# EAGLE design connector_v3 (EAGLE 7.3.0)
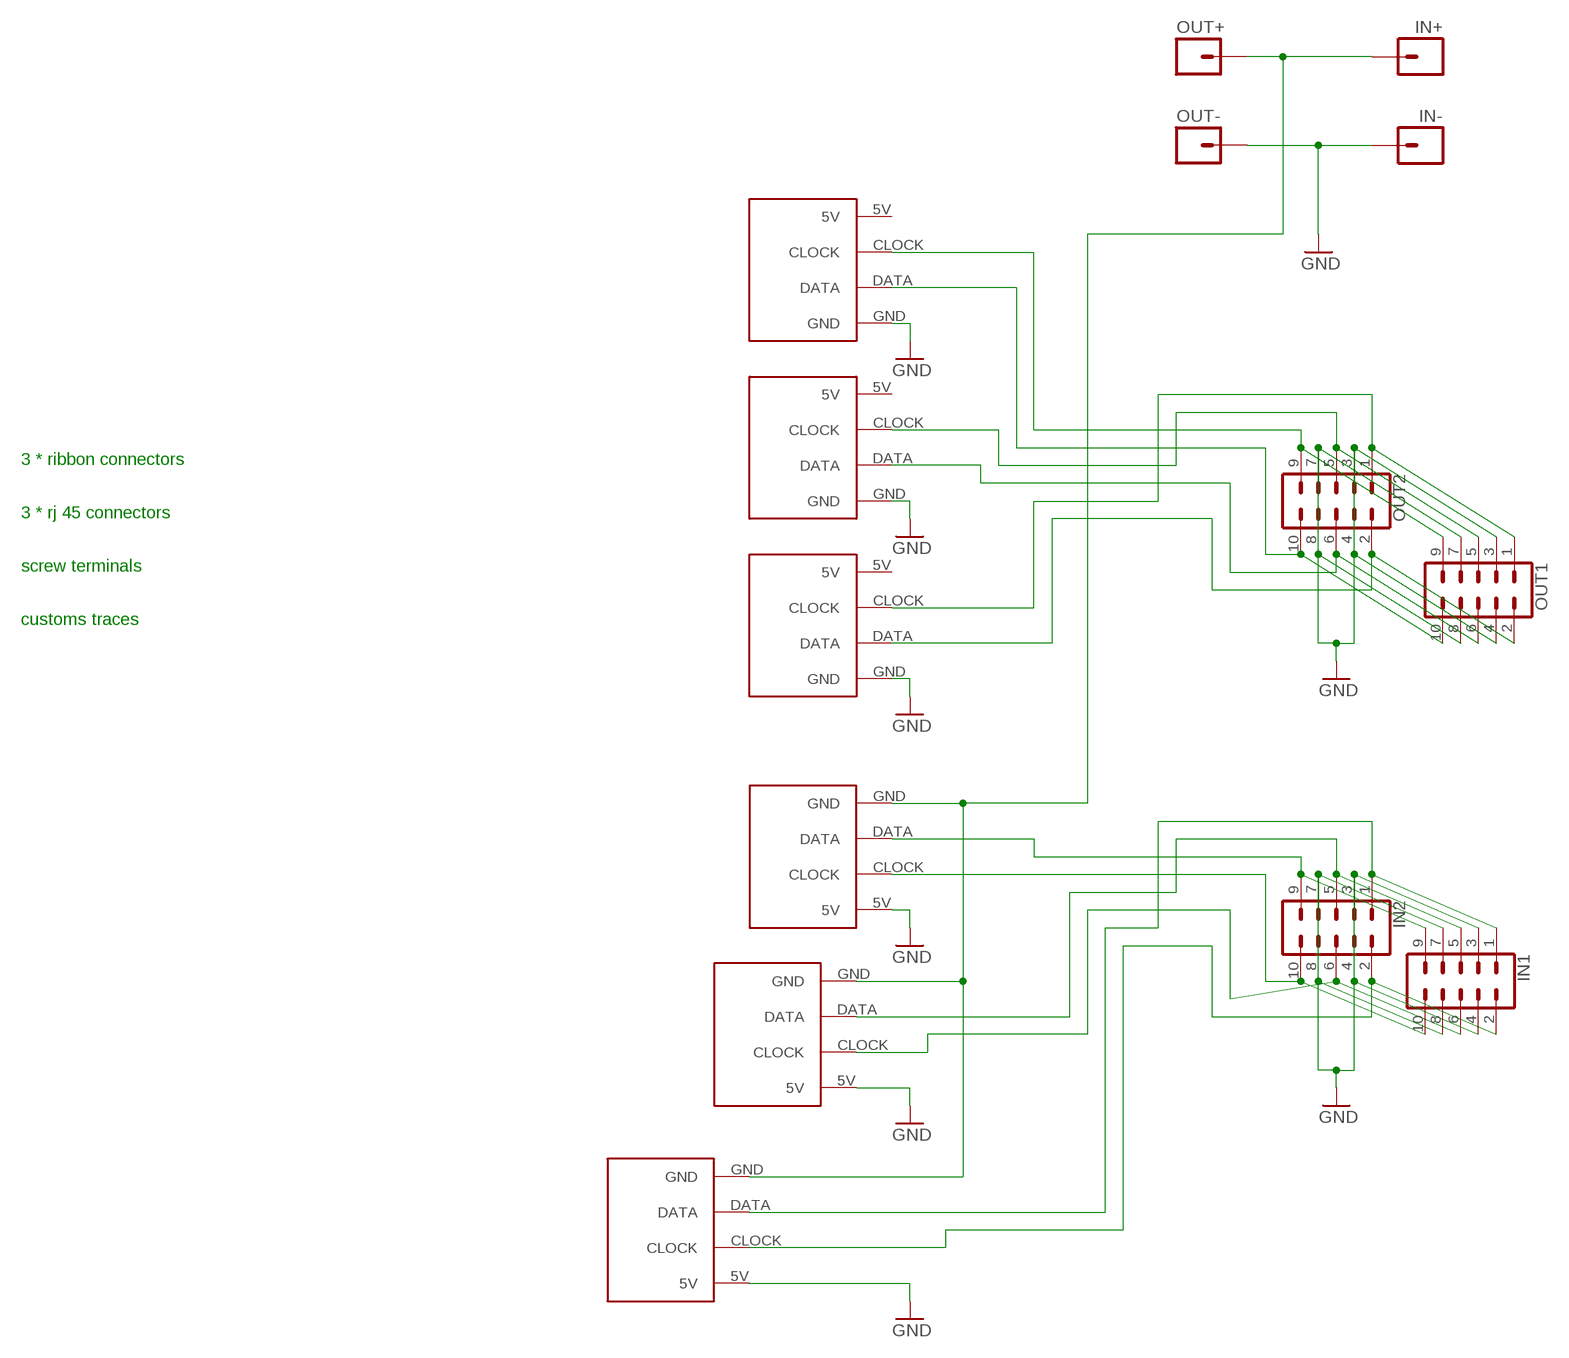
[diagram p0: schematic, sheet 1]

## Parts
IN1  CONN_05X2SHD_LOCK  [2X5-SHROUDED_LOCK]
IN2  CONN_05X2SHD_LOCK  [2X5-SHROUDED_LOCK]
IN+  M01PTH_2MM  [1X01_2MM]
IN-  M01PTH_2MM  [1X01_2MM]
INSTRIP1  APA102STRIP  [APA102STRIP]
INSTRIP2  APA102STRIP  [APA102STRIP]
INSTRIP3  APA102STRIP  [APA102STRIP]
OUT1  CONN_05X2SHD_LOCK  [2X5-SHROUDED_LOCK]
OUT2  CONN_05X2SHD_LOCK  [2X5-SHROUDED_LOCK]
OUT+  M01PTH_2MM  [1X01_2MM]
OUT-  M01PTH_2MM  [1X01_2MM]
OUTSTRIP1  APA102STRIP  [APA102STRIP]
OUTSTRIP2  APA102STRIP  [APA102STRIP]
OUTSTRIP3  APA102STRIP  [APA102STRIP]

## Nets
GND: IN1.3 IN1.4 IN1.7 IN1.8 IN2.3 IN2.4 IN2.7 IN2.8 IN-.1 INSTRIP1.5V INSTRIP2.5V INSTRIP3.5V OUT1.3 OUT1.4 OUT1.7 OUT1.8 OUT2.3 OUT2.4 OUT2.7 OUT2.8 OUT-.1 OUTSTRIP1.GND OUTSTRIP2.GND OUTSTRIP3.GND
N$1: IN1.9 IN2.9 INSTRIP3.DATA
N$2: IN1.10 IN2.10 INSTRIP3.CLOCK
N$3: IN1.5 IN2.5 INSTRIP2.DATA
N$4: IN1.6 IN2.6 INSTRIP2.CLOCK
N$5: IN1.1 IN2.1 INSTRIP1.DATA
N$6: IN1.2 IN2.2 INSTRIP1.CLOCK
N$8: IN+.1 INSTRIP1.GND INSTRIP2.GND INSTRIP3.GND OUT+.1
N$9: OUT1.9 OUT2.9 OUTSTRIP3.CLOCK
N$10: OUT1.10 OUT2.10 OUTSTRIP3.DATA
N$11: OUT1.5 OUT2.5 OUTSTRIP2.CLOCK
N$12: OUT1.6 OUT2.6 OUTSTRIP2.DATA
N$13: OUT1.1 OUT2.1 OUTSTRIP1.CLOCK
N$14: OUT1.2 OUT2.2 OUTSTRIP1.DATA
Unconnected: OUTSTRIP1.5V OUTSTRIP2.5V OUTSTRIP3.5V

## Notes on the sheet
- 3 * ribbon connectors
- 3 * rj 45 connectors
- screw terminals
- customs traces

## Library data of the parts
IN1 IN2 OUT1 OUT2 = SparkFun-Connectors:CONN_05X2: Multi connection point. Often used as Generic Header-pin footprint for 0.1 inch spaced/style header connections For AVR SPI programming port, see special device with nice symbol: "AVR_SPI_PROG_5x2.dev" You can populate with any combo of single row headers, but if you'd like an exact match, check these: 2x5 AVR ICSP Male Header <https://www.sparkfun.com/products/778> (PRT-00778) 2x5 Pin Shrouded Header <https://www.sparkfun.com/products/8506> (PRT-08506) On any of the 0.1 inch spaced packages, you can populate with these: Break Away Headers - Straight <https://www.sparkfun.com/products/116> (PRT-00116) Break Away Male Headers - Right Angle <https://www.sparkfun.com/products/553> (PRT-00553) Female Headers <https://www.sparkfun.com/products/115> (PRT-00115) Break Away Headers - Machine Pin <https://www.sparkfun.com/products/117> (PRT-00117) Break Away Female Headers - Swiss Machine Pin <https://www.sparkfun.com/products/743> (PRT-00743) Special note: the shrouded connector mates well with our 5x2 ribbon cables: 2x5 Pin IDC Ribbon Cable <https://www.sparkfun.com/products/8535> (PRT-08535); PROD_ID: CONN-08671; SF_ID: PRT-08506
IN+ IN- OUT+ OUT- = SparkFun-Connectors:M01: Header 1 Standard 1-pin 0.1" header. Use with straight break away headers (SKU : PRT-00116), right angle break away headers (PRT-00553), swiss pins (PRT-00743), machine pins (PRT-00117), and female headers (PRT-00115). SMTSO-256-ET is a "flush mount" nut for a 4-40 screw. The older package used to be too tight, and did not allow it to sit properly thru the drill hit. The latest (0.165DIA) fits nice and snug.
INSTRIP1-INSTRIP3 OUTSTRIP1-OUTSTRIP3 = LucasParis:APA102STRIP

## Board
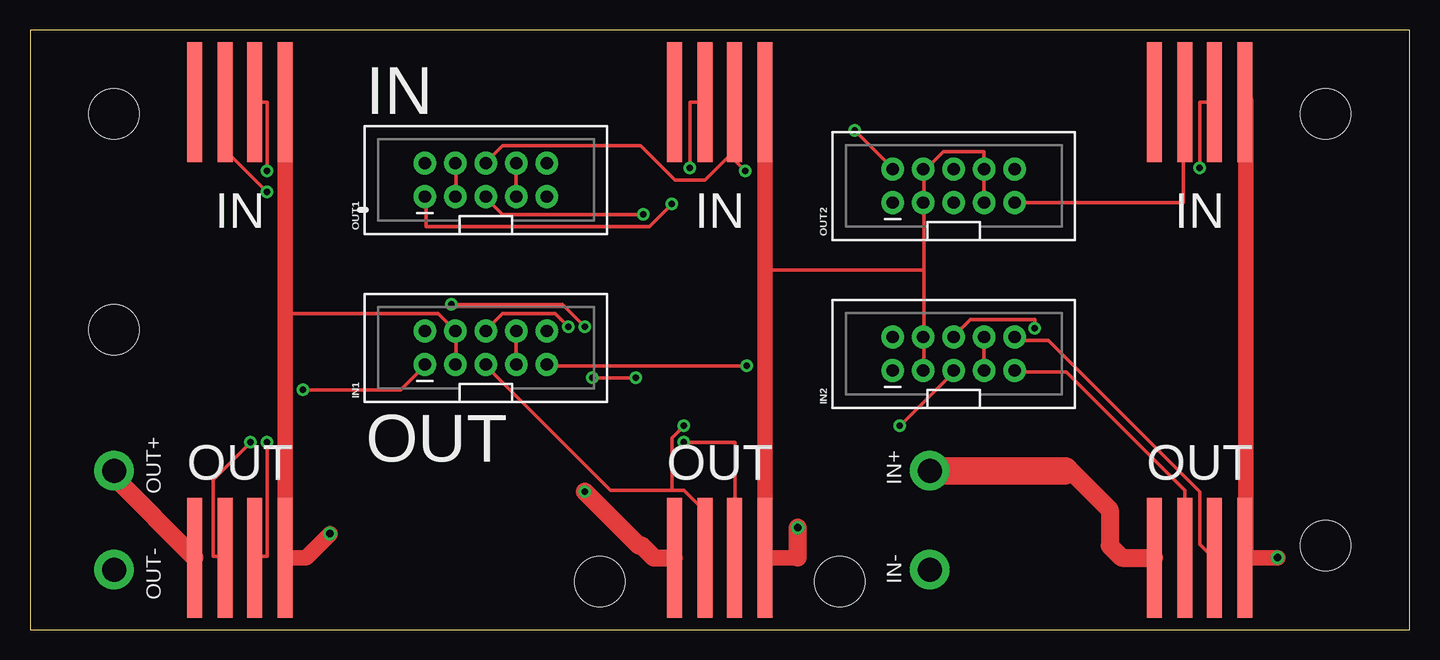
[diagram p1: board, top side]
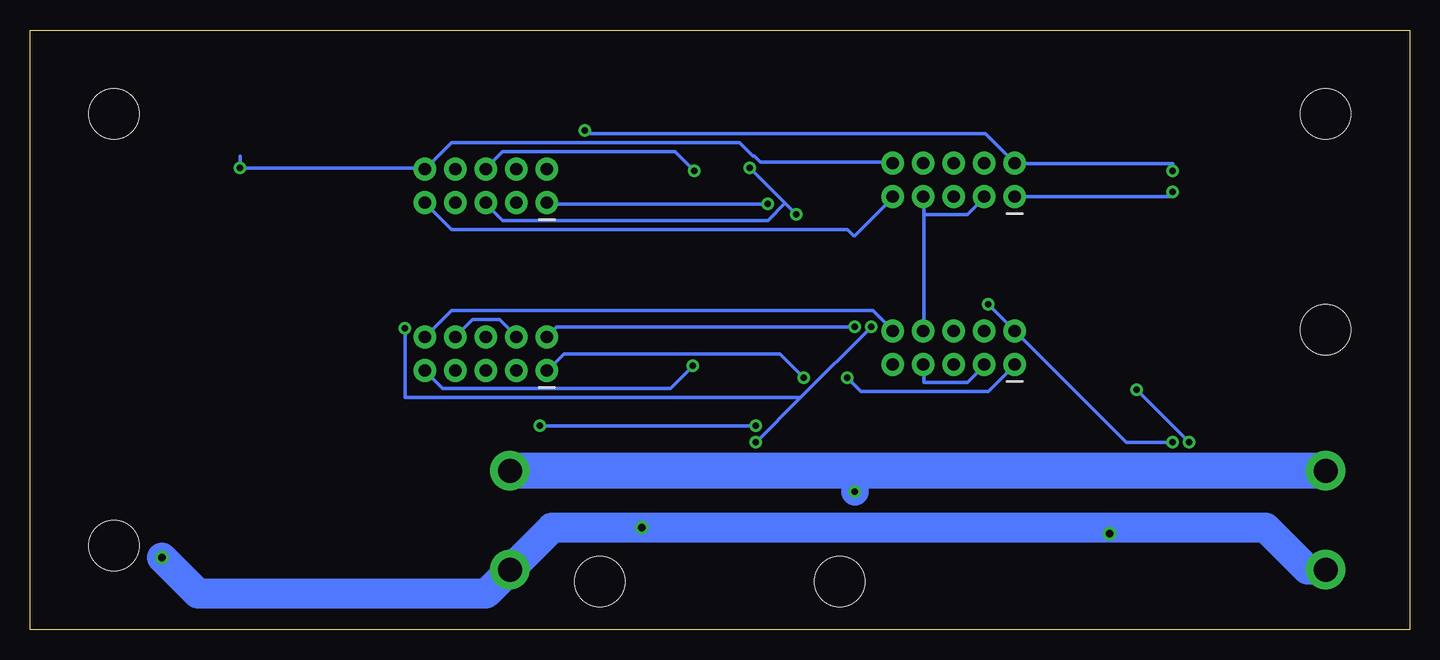
[diagram p2: board, bottom side, seen from below]

Size 115 x 50 mm. Coordinates in mm from the lower left corner, seen from the top.
Outline: 0,0 115,0 115,50 0,50 0,0
Copper layers (1*16): Top 0.035mm / dielectric 1.5mm / Bottom 0.035mm
Design rules "myRules_18_10_14 *": minimum track width 12mil, minimum drill 20mil, track to track 16mil, track to pad 14mil, pad to pad 8mil, via to via 12mil, smd to smd 8mil, copper to edge 10mil, drill to drill 8mil, minimum pad ring 12mil, minimum via ring 10mil, stop-mask expansion 4mil, vias tented up to drill 25mil, thermal gap 10mil
Holes 4.2 mm at 7,43 7,25 47.5,4 67.5,4 108,43 108,7

### Footprints (pad centres in the part's own frame; a part is rotated, then mirrored left to right if it is on the bottom)
2X5-SHROUDED_LOCK = drill 1.016 pad 1.88: 1 -1.397,5.08; 2 1.397,5.08; 3 -1.397,2.54; 4 1.397,2.54; 5 -1.397,0; 6 1.397,0; 7 -1.397,-2.54; 8 1.397,-2.54; 9 -1.397,-5.08; 10 1.397,-5.08
1X01_2MM = drill 2 pad 3.302: 1 0,0
APA102STRIP = smd 1.27 x 10: 5V 3.775,1; CLOCK 1.225,1; DATA -1.225,1; GND -3.775,1

### Placement (x,y rotation side)
IN1  38,23.5 90 top
IN2  77,23 90 top
IN+  75,13.25 0 top
IN-  75,5 0 top
INSTRIP1  17.5,5 0 top
INSTRIP2  57.5,5 0 top
INSTRIP3  97.5,5 0 top
OUT1  38,37.5 90 top
OUT2  77,37 90 top
OUT+  7,13.25 0 top
OUT-  7,5 0 top
OUTSTRIP1  17.5,45 180 top
OUTSTRIP2  57.5,45 180 top
OUTSTRIP3  97.5,45 180 top

### Tracks (layer width: path | path; a pad name or v marks a point on that pad's centre or on a via)
GND  (via drill 0.6)
  Top 0.305: 101.28,45 101.35,44.81 101.35,44.09 OUTSTRIP3.GND | IN1.3 35.5,22.12 35.5,24.88 IN1.4 35.38,25 34,26.38 21.27,26.38 | IN1.7 40.5,22.12 40.5,24.88 IN1.8 | OUT1.3 35.5,36.12 35.5,38.88 OUT1.4 | OUT1.7 40.5,36.12 40.5,38.88 OUT1.8 | IN2.3 74.5,21.62 74.5,24.38 IN2.4 74.5,24.5 74.5,30 | IN2.7 79.5,21.62 79.5,24.38 IN2.8 | OUT2.7 79.5,35.62 79.5,38.38 OUT2.8 79.5,38.5 79.5,39.88 76.12,39.88 74.62,38.38 OUT2.4 74.5,38.38 74.5,35.62 OUT2.3 74.5,35.5 74.5,30 | 61.27,30 74.5,30
  Top 1.3: 64,6 INSTRIP2.5V 61.27,30 OUTSTRIP2.GND | v25,8 23,6 INSTRIP1.5V 21.27,26.38 OUTSTRIP1.GND | 101.35,44.09 101.35,6.07 INSTRIP3.5V v104,6
  Top 1.5: 64,6 v64,8.5
  Bottom 0.305: IN1.3 35.5,22 36.88,20.62 40.5,20.62 40.5,22 IN1.7 | 40.5,34.62 36.88,34.62 35.5,36 OUT1.3 | 40.5,34.62 40.5,36 OUT1.7 | 40.5,34.62 40.5,25 IN1.8 | IN2.4 74.5,24.5 75.88,25.88 78.12,25.88 79.5,24.5 IN2.8
  Bottom 1.3: v25,8 25,8.5
  Bottom 2.5: OUT-.1 8.5,5 12,8.5 25,8.5 v64,8.5 71.5,8.5 IN-.1 77,3 101,3 v104,6
N$1  (via drill 0.51)
  Top 0.305: v59.75,22 43.12,22 IN1.9 | 96.25,9.88 96.25,6 INSTRIP3.DATA 96.25,10 96.25,11.62 86.38,21.5 82.12,21.5 IN2.9
  Bottom 0.305: v59.75,22 61.62,20.12 80.62,20.12 82,21.5 IN2.9
N$2
  Top 0.305: INSTRIP3.CLOCK 98.62,6 97.5,7.12 97.5,11.5 84.88,24.12 82.12,24.12 82.12,24.38 IN2.10
  Bottom 0.305: IN1.10 43.12,25 44.75,26.62 79.88,26.62 82,24.5 IN2.10
N$3  (via drill 0.51)
  Top 0.305: 53.5,11.62 54.5,11.62 56.25,9.88 56.25,6 INSTRIP2.DATA | 53.5,11.62 48.38,11.62 38,22 IN1.5 | v72.5,17 77,21.5 IN2.5 | v54.5,17 53.5,16 53.5,11.62
  Bottom 0.305: v54.5,17 v72.5,17
N$4  (via drill 0.51)
  Top 0.305: 58.73,5 58.67,5.33 58.75,5.38 58.75,5.62 INSTRIP2.CLOCK | 58.67,5.69 INSTRIP2.CLOCK | v54.5,15.62 58.75,15.62 58.75,6.12 INSTRIP2.CLOCK | v44.88,25.25 43.75,26.38 39.38,26.38 38,25 IN1.6 | v83.75,25.12 83.75,25.88 78.38,25.88 77,24.5 IN2.6
  Bottom 0.305: v44.88,25.25 50.81,19.31 | 50.81,19.31 v54.5,15.62 | v83.75,25.12 83.75,19.38 50.88,19.38 50.81,19.31
N$5  (via drill 0.51)
  Top 0.305: 16.27,5 16.36,5.33 16.36,5.69 INSTRIP1.DATA 16.25,6.12 15.25,6.12 15.25,12.5 v18.38,15.62 | v22.75,20 30.88,20 32.88,22 IN1.1 | v46.88,21 v50.5,21
  Bottom 0.305: v18.38,15.62 v22.75,20 | v50.5,21 52.5,23 70.5,23 71.88,21.62 IN2.1 | v46.88,21 45.75,19.88 35.12,19.88 33,22 IN1.1
N$6  (via drill 0.51)
  Top 0.305: 18.73,5 18.85,5.33 18.85,5.69 INSTRIP1.CLOCK 18.75,6.12 19.75,6.12 v19.75,15.62 | v46.25,25.25 44.38,27.12 v35.12,27.12
  Bottom 0.305: v19.75,15.62 23.62,15.62 32.88,24.88 IN1.2 33,25 v35.12,27.12 | v46.25,25.25 71.12,25.25 71.88,24.5 IN2.2
N$8  (via drill 0.51)
  Top 0.305: 13.51,6.76 13.51,6.04 INSTRIP1.GND | 7.11,13.16 OUT+.1 | 53.7,6.04 INSTRIP2.GND
  Top 1.4: 52,6 INSTRIP2.GND
  Top 1.5: v46.25,11.5 50.75,7 51,7 52,6 | 86.25,13.25 86.75,13.25 90,10 90,7 91,6 INSTRIP3.GND | OUT+.1 7,12.72 INSTRIP1.GND
  Top 2.286: 86.25,13.25 IN+.1
  Bottom 0.305: 53.7,12.09 53.7,13.25
  Bottom 2.286: v46.25,11.5 46.25,13.25
  Bottom 3: OUT+.1 46.25,13.25 53.7,13.25 IN+.1
N$9
  Top 0.305: 96.28,45 96.37,44.81 96.37,44.09 OUTSTRIP3.CLOCK | 96.25,40.12 96.25,43.88 OUTSTRIP3.CLOCK | OUT2.9 82.12,35.62 96.12,35.62 96.12,40.12 OUTSTRIP3.CLOCK
  Bottom 0.305: OUT1.9 43.12,36 46.25,32.88 46.38,32.88 46.88,33.38 79.88,33.38 82,35.5 OUT2.9
N$10  (via drill 0.51)
  Top 0.305: v97.5,38.5 97.5,44 OUTSTRIP3.DATA
  Bottom 0.305: 97.5,39.5 v97.5,38.5 82.12,38.5 OUT2.10 82,38.5 79.88,40.62 55.88,40.62 54.75,39.5 54.62,39.5 54.12,39 43.12,39 OUT1.10
N$11  (via drill 0.51)
  Top 0.305: v51.12,34.62 39.38,34.62 38,36 OUT1.5 | v55,38.5 55,44 OUTSTRIP2.CLOCK
  Bottom 0.305: v55,38.5 52.06,35.56 | 52.06,35.56 v51.12,34.62 | 52.06,35.56 53.5,34.12 75.62,34.12 77,35.5 OUT2.5
N$12  (via drill 0.51)
  Top 0.305: OUT1.6 38,39 39.38,40.38 50.88,40.38 53.75,37.5 56.25,37.5 58.62,39.88 58.62,44 OUTSTRIP2.DATA 58.38,39.5 v59.62,38.25
  Bottom 0.305: v59.62,38.25 61.25,39.88 75.62,39.88 77,38.5 OUT2.6
N$13  (via drill 0.51)
  Top 0.305: v19.75,36.5 16.38,39.88 16.38,44 OUTSTRIP1.CLOCK | v53.5,35.5 51.62,33.62 33,33.62 33,36 OUT1.1
  Bottom 0.305: v19.75,36.5 19.75,36.12 32.88,36.12 OUT1.1 | v53.5,35.5 71.88,35.5 OUT2.1
N$14  (via drill 0.51)
  Top 0.305: v19.75,38.25 19.75,44 OUTSTRIP1.DATA | v68.75,41.62 71.88,38.5 OUT2.2
  Bottom 0.305: v19.75,38.25 19.75,38.88 32.88,38.88 OUT1.2 33,39 35.38,41.38 68.5,41.38 v68.75,41.62

### Text on the board
tNames: IN | IN | IN | IN | OUT | OUT | OUT | OUT